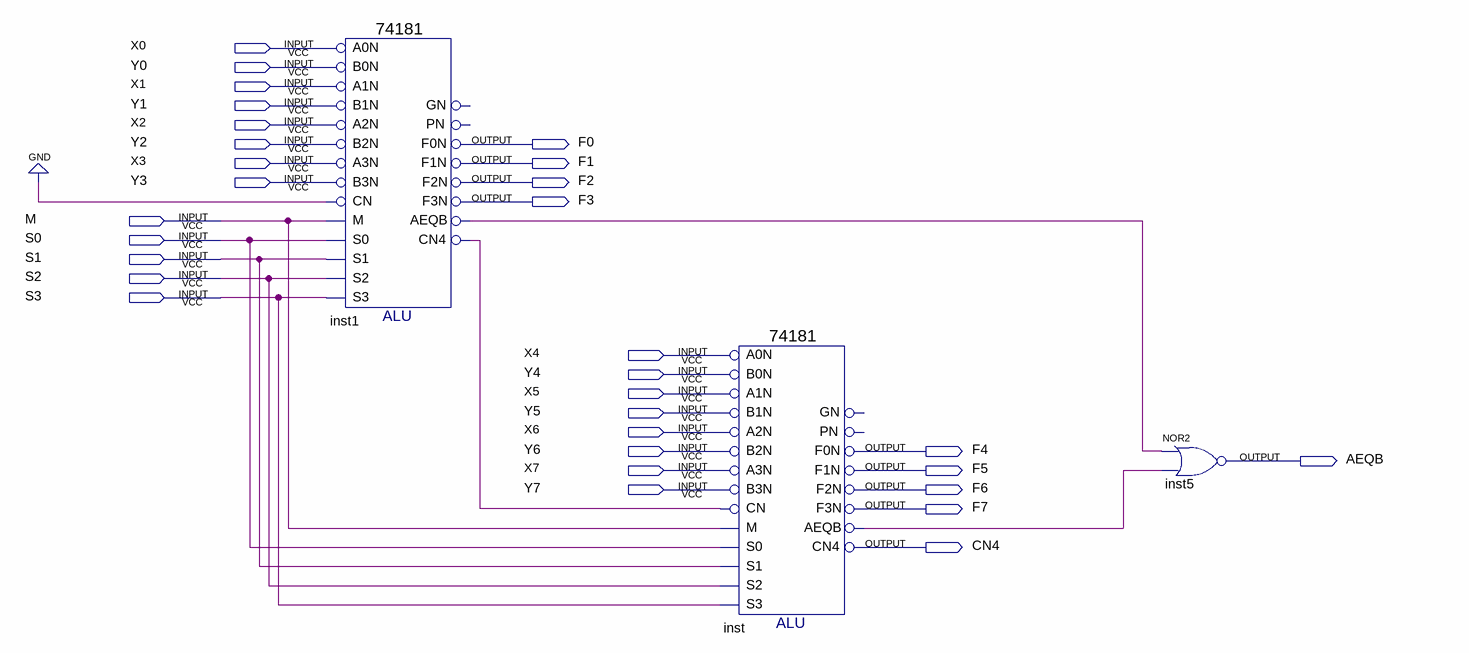
[diagram p0: schematic sheet]
// Quartus schematic 74181_8_bit.bdf as structural Verilog: 3 symbols, 31 pins
module \74181_8_bit  (
  input  X0,
  input  Y0,
  input  X1,
  input  Y1,
  input  X2,
  input  Y2,
  input  X3,
  input  Y3,
  input  M,
  input  S0,
  input  S1,
  input  S2,
  input  S3,
  input  X4,
  input  Y4,
  input  X5,
  input  Y5,
  input  X6,
  input  Y6,
  input  X7,
  input  Y7,
  output F0,
  output F1,
  output F2,
  output F3,
  output F4,
  output AEQB,
  output F5,
  output F6,
  output F7,
  output CN4
);

  wire inst1_aeqb, inst1_cn4, inst_aeqb;

  \74181  inst1 (
    .B0N(Y0), .A0N(X0), .A1N(X1), .B1N(Y1), .A3N(X3), .B2N(Y2), .A2N(X2), .M(M), .CN(1'b0), .B3N(Y3),
    .S2(S2), .S1(S1), .S0(S0), .S3(S3), .F3N(F3), .F1N(F1), .F0N(F0), .AEQB(inst1_aeqb), .CN4(inst1_cn4),
    .F2N(F2));  // open: PN, GN
  \74181  inst (
    .B0N(Y4), .A0N(X4), .A1N(X5), .B1N(Y5), .A3N(X7), .B2N(Y6), .A2N(X6), .M(M), .CN(inst1_cn4), .B3N(Y7),
    .S2(S2), .S1(S1), .S0(S0), .S3(S3), .F3N(F7), .F1N(F5), .F0N(F4), .AEQB(inst_aeqb), .CN4(CN4), .F2N(F6));  // open: PN, GN
  nor inst5 (AEQB, inst1_aeqb, inst_aeqb);
endmodule
